# Altium schematic sheet Power.SchDoc
size A4; SheetNumber: 4; SheetTotal: 4
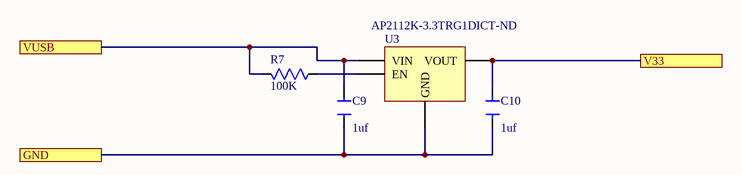
[diagram p0: Power.SchDoc]

## Parts
C9  value 1uf  [CAP_0402]  (hidden comment: Cap)
C10  value 1uf  [CAP_0402]  (hidden comment: Cap)
R7  value 100K  [RES_0402]  (hidden comment: Res)
U3  Supplier Part Number 1: AP2112K-3.3TRG1DICT-ND  [SOT23-5]  (hidden comment: AP2112K-3.3TRG1)

## Ports
GND, V33, VUSB

## Nets
GND: C9.2 C10.2 U3.3(GND) ; port GND
V33: C10.1 U3.4(VOUT) ; port V33
VUSB: C9.1 R7.1 U3.1(VIN) ; port VUSB
NetR7_2: R7.2 U3.2(EN)

## Library data of the parts
U3 = AP2112K-3.3TRG1: IC REG LINEAR 3.3V 600MA SOT23-5; pin to pad: 2>3 3>2 4>5; Manufacturer: Diodes; Number of Regulators: 1; Quiescent Current: 55uA; Polarity: Positive; Max Input Voltage: 6V; Min Input Voltage: 2.5V; Accuracy: 1.5%; Dropout Voltage: 250mV; Output Type: Fixed; Supplier 1: Digi-Key; Manufacturer Part Number: AP2112K-3.3TRG1; RoHS: Yes; Category: Voltage Regulators - Linear; Stock 1: 54786; Pricing 1: 1=0.47000, 10=0.35500, 25=0.32000, 100=0.17450, 250=0.16872, 500=0.15126, 1000=0.11636 (USD); Mount: Surface Mount; Case/Package: SOT-23-5; Number of Pins: 5; Min Operating Temperature: -40°C; Max Operating Temperature: 85°C; Output Current: 600mA; Max Output Current: 600mA; Output Voltage: 3.3V; Number of Outputs: 1; Package Quantity: 1; Packaging: Tape and Reel; Length: 3.1mm; Height: 1.3mm; Width: 1.7mm; Lead Free: Lead Free; ComponentLink1URL: https://datasheet.ciiva.com/29569/ap2112-29569919.pdf?src-supplier=Digi-Key; ComponentLink1Description: https://datasheet.ciiva.com/29569/ap2112-29569919.pdf?src-supplier=Digi-Key; ComponentLink2URL: https://datasheet.ciiva.com/30016/ap2112-30016792.pdf?src-supplier=Avnet; ComponentLink2Description: https://datasheet.ciiva.com/30016/ap2112-30016792.pdf?src-supplier=Avnet; ComponentLink3URL: https://datasheet.ciiva.com/29569/ap2112-29569917.pdf?src-supplier=Digi-Key; ComponentLink3Description: https://datasheet.ciiva.com/29569/ap2112-29569917.pdf?src-supplier=Digi-Key; ComponentLink4URL: https://datasheet.ciiva.com/29569/ap2112-29569918.pdf?src-supplier=Digi-Key; ComponentLink4Description: https://datasheet.ciiva.com/29569/ap2112-29569918.pdf?src-supplier=Digi-Key